# EAGLE design Vayu (EAGLE 9.6.2)

## Sheet 1 of 6: Table of Content
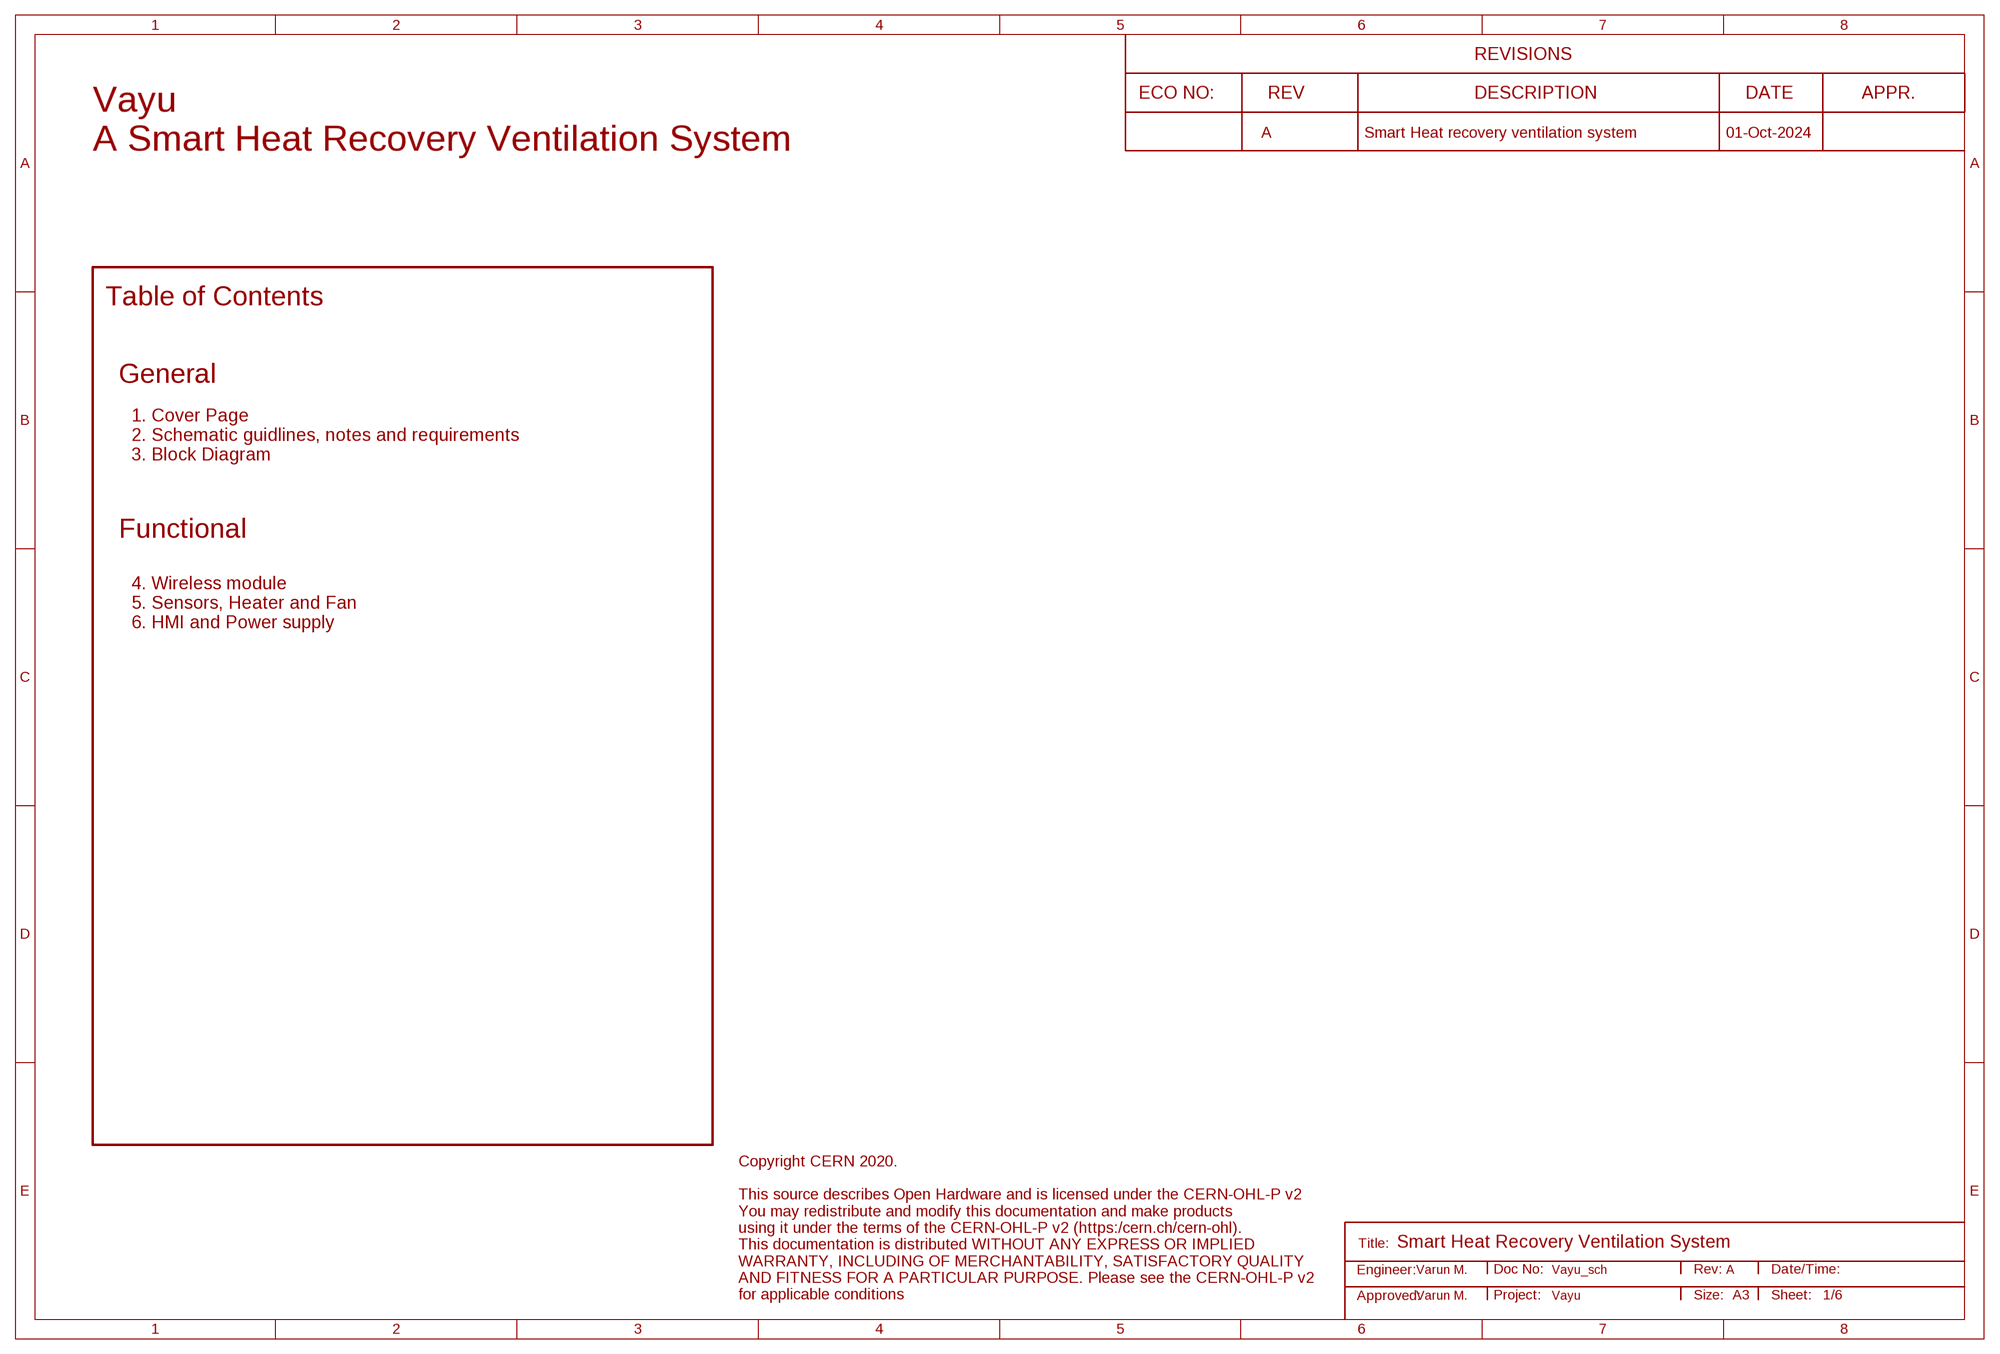
[diagram p0: schematic, sheet 1]
U$1 (A3L-LOC-CERN-OHL-P-V2-TOC): APPROVER: Varun M.; DESCRIPTION: Smart Heat recovery ventilation system; DESIGNER: Varun M.; DOC_NO: Vayu_sch; PROJECT_NAME: Vayu; PROJECT_START_DATE: 01-Oct-2024; REV: A

### Notes on the sheet
- Vayu
  A Smart Heat Recovery Ventilation System
- General
- 1. Cover Page
  2. Schematic guidlines, notes and requirements
  3. Block Diagram
- Functional
- 4. Wireless module
  5. Sensors, Heater and Fan
  6. HMI and Power supply
- Smart Heat Recovery Ventilation System

## Sheet 2 of 6: Schematic Guidelines
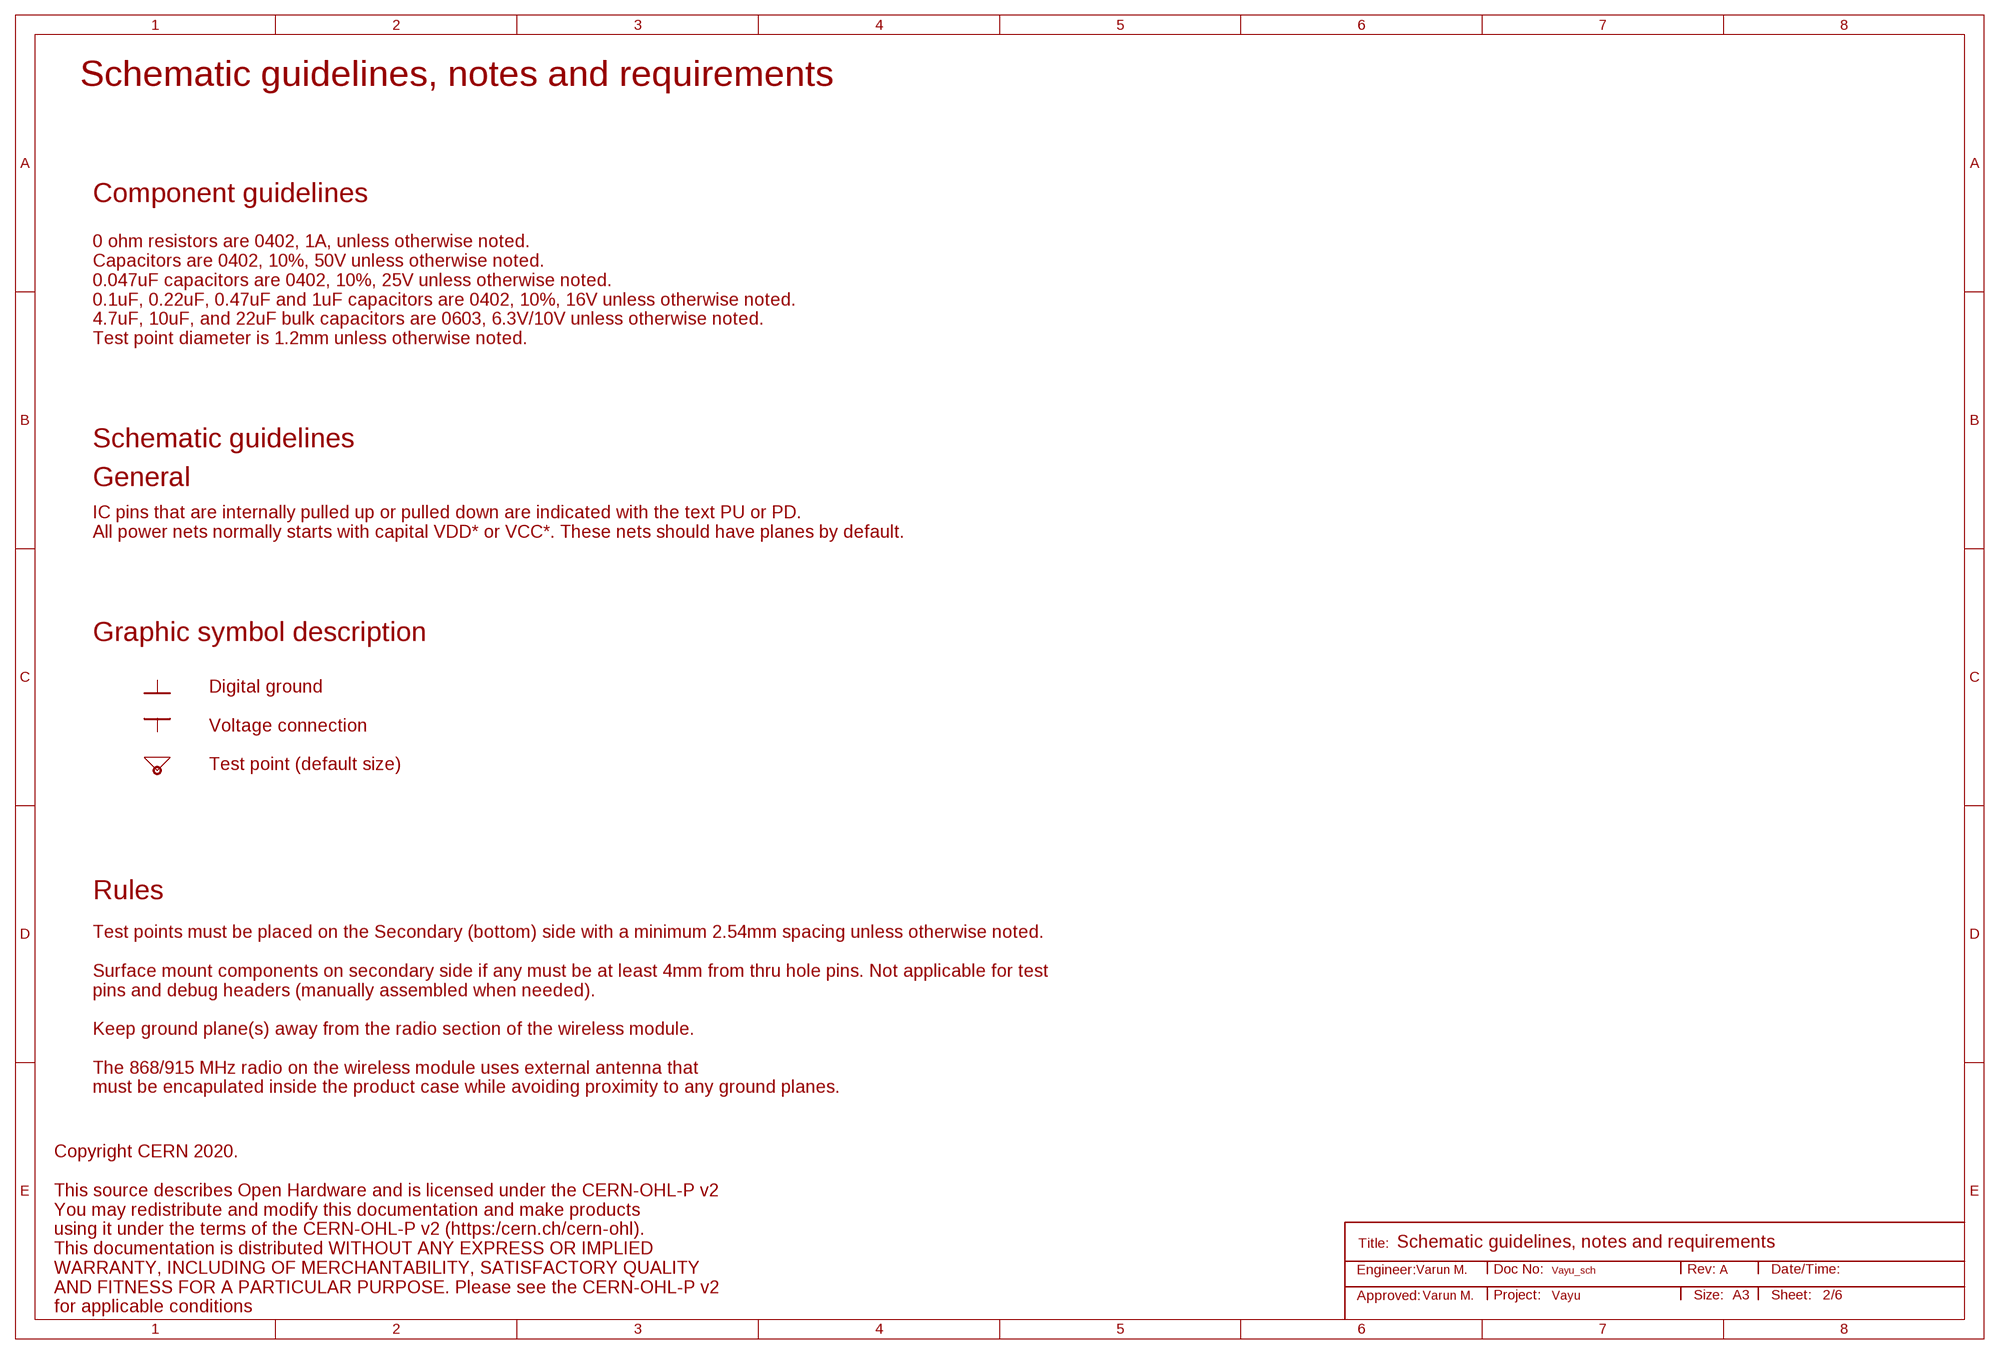
[diagram p1: schematic, sheet 2]
FRAME1 (A3L-LOC-CERN-OHL-P-V2): APPROVER: Varun M.; DESIGNER: Varun M.; DOC_NO: Vayu_sch; PROJECT_NAME: Vayu; REV: A

### Notes on the sheet
- Schematic guidelines, notes and requirements
- Component guidelines
- 0 ohm resistors are 0402, 1A, unless otherwise noted.
  Capacitors are 0402, 10%, 50V unless otherwise noted.
  0.047uF capacitors are 0402, 10%, 25V unless otherwise noted.
  0.1uF, 0.22uF, 0.47uF and 1uF capacitors are 0402, 10%, 16V unless otherwise noted.
  4.7uF, 10uF, and 22uF bulk capacitors are 0603, 6.3V/10V unless otherwise noted.
  Test point diameter is 1.2mm unless otherwise noted.
- Schematic guidelines
- General
- IC pins that are internally pulled up or pulled down are indicated with the text PU or PD.
  All power nets normally starts with capital VDD* or VCC*. These nets should have planes by default.
- Graphic symbol description
- Digital ground
  
  Voltage connection
  
  Test point (default size)
- Rules
- Test points must be placed on the Secondary (bottom) side with a minimum 2.54mm spacing unless otherwise noted.
  
  Surface mount components on secondary side if any must be at least 4mm from thru hole pins. Not applicable for test
  pins and debug headers (manually assembled when needed).
  
  Keep ground plane(s) away from the radio section of the wireless module.
  
  The 868/915 MHz radio on the wireless module uses external antenna that
  must be encapulated inside the product case while avoiding proximity to any ground planes.
- Schematic guidelines, notes and requirements

## Sheet 3 of 6: Block Diagram
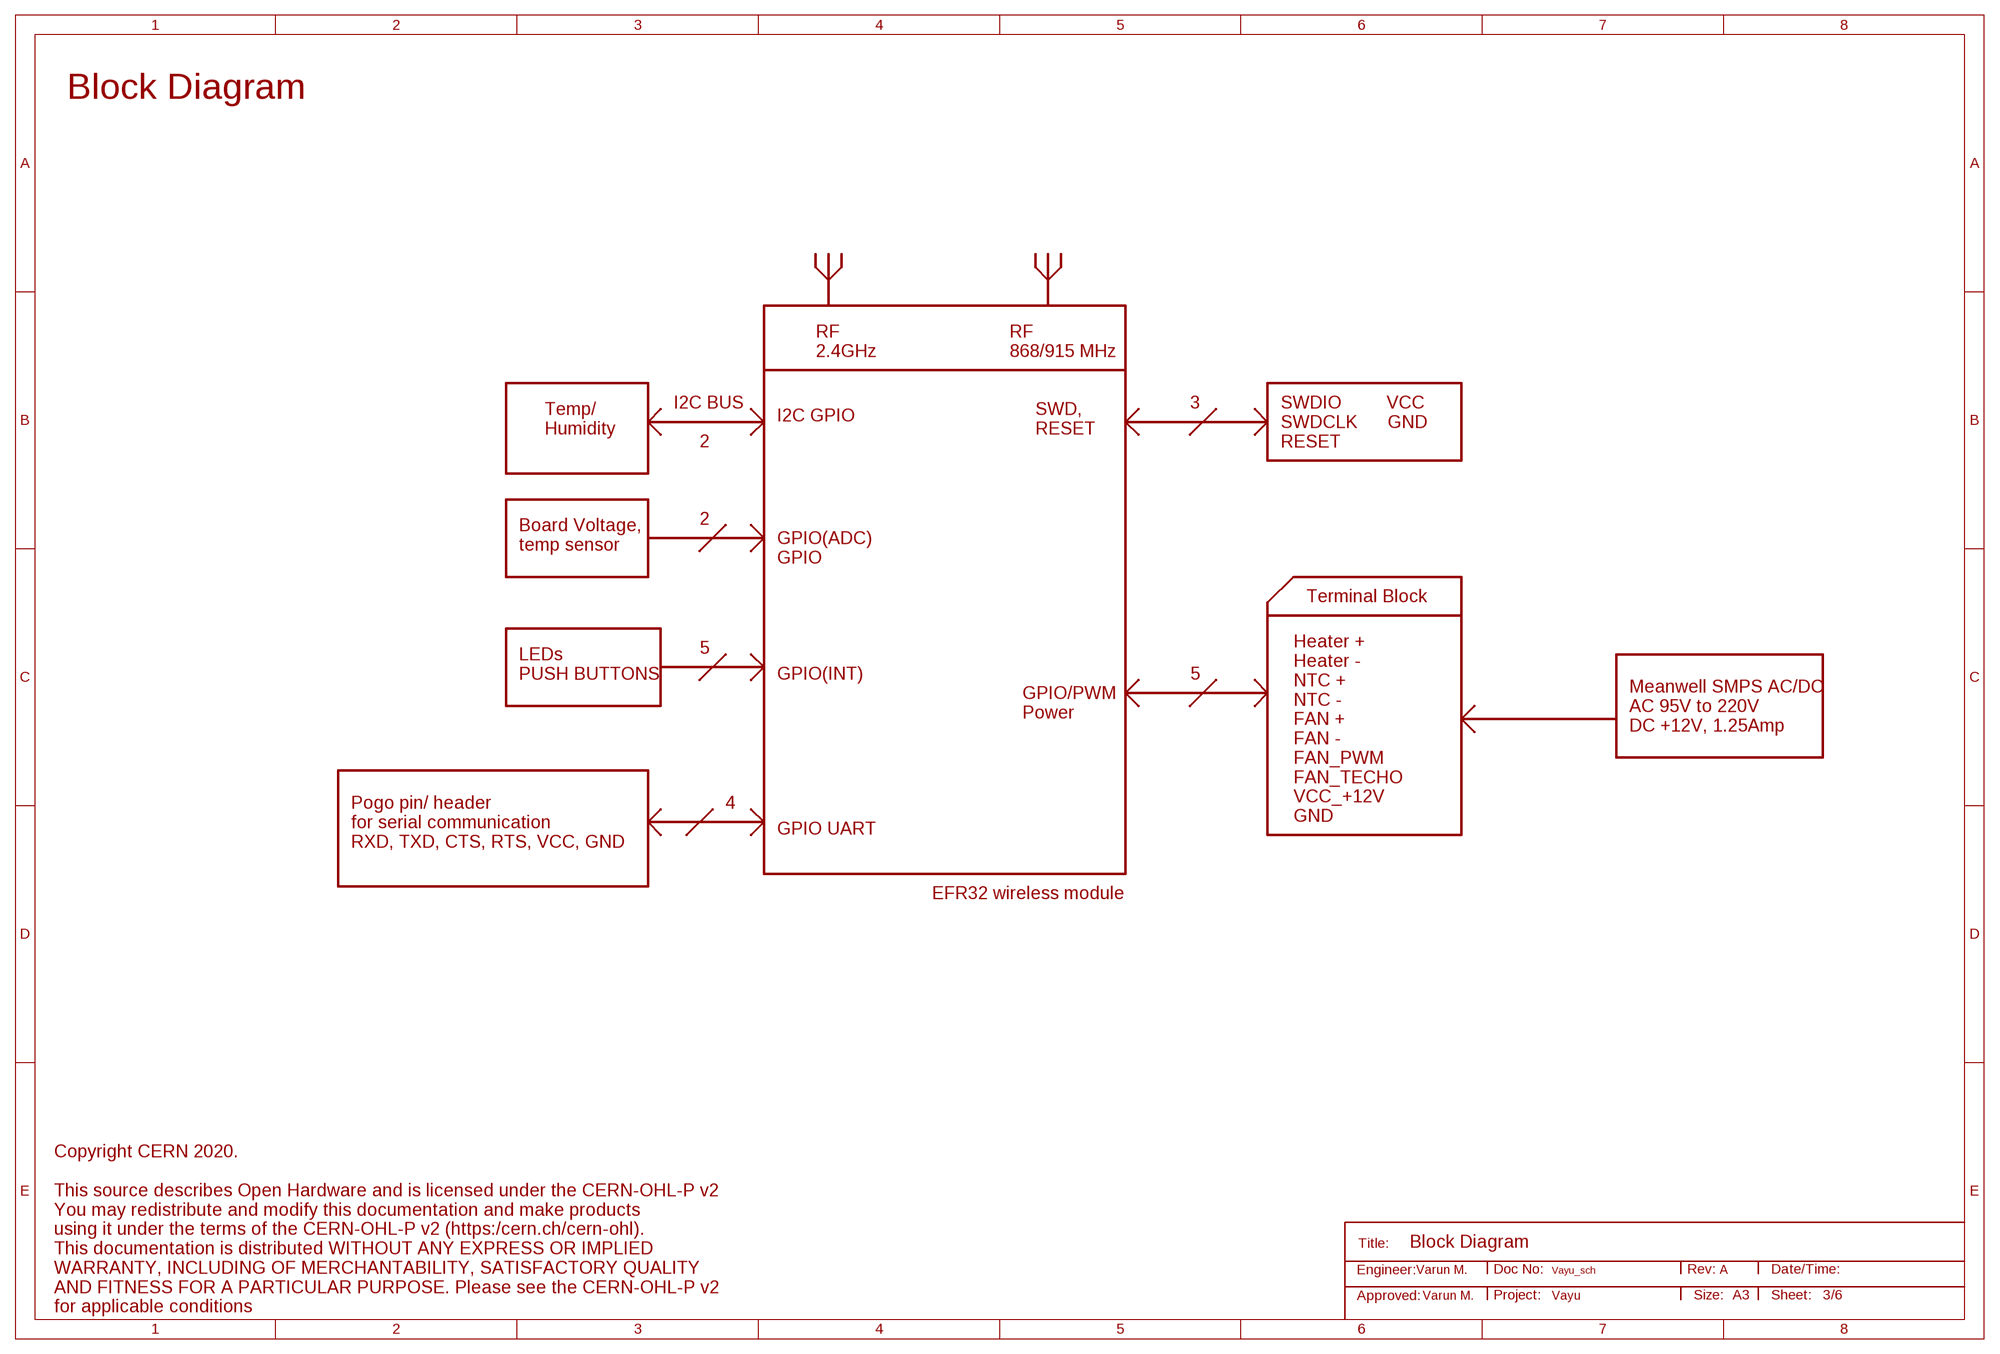
[diagram p2: schematic, sheet 3]
FRAME2 (A3L-LOC-CERN-OHL-P-V2): APPROVER: Varun M.; DESIGNER: Varun M.; DOC_NO: Vayu_sch; PROJECT_NAME: Vayu; REV: A

### Notes on the sheet
- Block Diagram
- RF
  2.4GHz
- RF
  868/915 MHz
- I2C BUS | 3
- I2C GPIO
- Temp/
  Humidity
- SWD,
  RESET
- 2
- SWDIO         VCC
  SWDCLK      GND
  RESET
- 2
- Board Voltage,
  temp sensor
- GPIO(ADC)
  GPIO
- Terminal Block
- 5
- LEDs
  PUSH BUTTONS
- GPIO(INT) | 5
- GPIO/PWM
  Power
- Meanwell SMPS AC/DC
  AC 95V to 220V
  DC +12V, 1.25Amp
- 4
- Heater +
  Heater -
  NTC +
  NTC -
  FAN +
  FAN -
  FAN_PWM
  FAN_TECHO
  VCC_+12V
  GND
- GPIO UART
- Pogo pin/ header
  for serial communication
  RXD, TXD, CTS, RTS, VCC, GND
- EFR32 wireless module
- Block Diagram

## Sheet 4 of 6: Wireless Mdoule
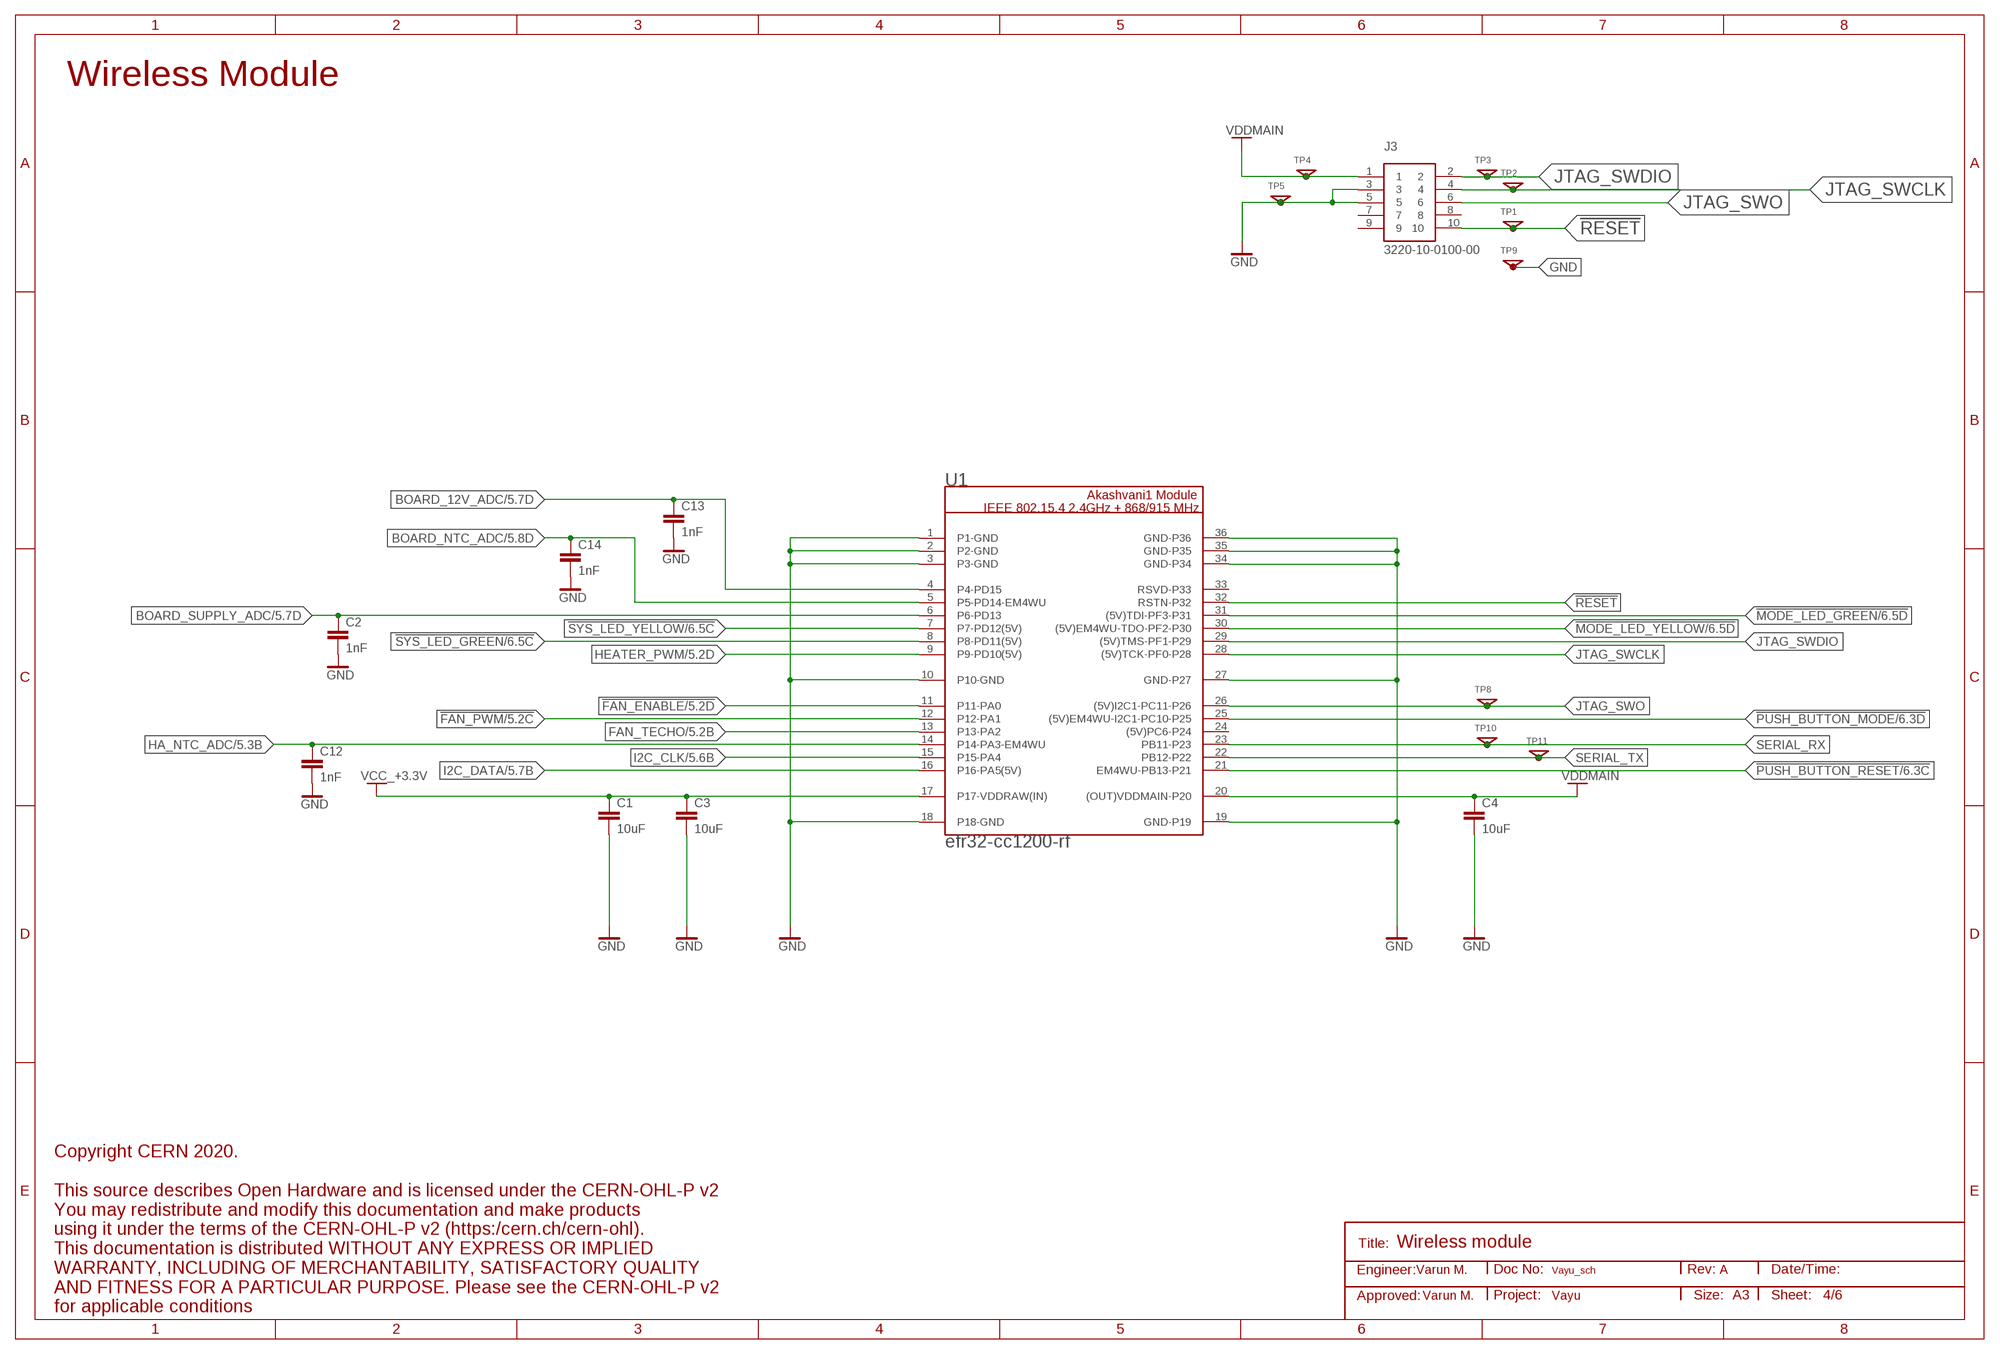
[diagram p3: schematic, sheet 4]
FRAME3 (A3L-LOC-CERN-OHL-P-V2): APPROVER: Varun M.; DESIGNER: Varun M.; DOC_NO: Vayu_sch; PROJECT_NAME: Vayu; REV: A

### Parts
C1  10uF  C-EUC0603  [C0603]
C2  1nF  C-EUC0402S  [CAPC1005X55N]
C3  10uF  C-EUC0603  [C0603]
C4  10uF  C-EUC0603  [C0603]
C12  1nF  C-EUC0402S  [CAPC1005X55N]
C13  1nF  C-EUC0402S  [CAPC1005X55N]
C14  1nF  C-EUC0402S  [CAPC1005X55N]
J3  3220-10-0100-00  [PIN2X5_1.27MM]
TP1  TP_1.2  [TP_1.2]
TP2  TP_1.2  [TP_1.2]
TP3  TP_1.2  [TP_1.2]
TP4  TP_1.2  [TP_1.2]
TP5  TP_1.2  [TP_1.2]
TP8  TP_1.2  [TP_1.2]
TP9  TP_1.2  [TP_1.2]
TP10  TP_1.2  [TP_1.2]
TP11  TP_1.2  [TP_1.2]
U1  efr32-cc1200-rf  AKASHVANI1  [AKASHVANI1]

### Nets
!FAN_ENABLE: U1.11(P11-PA0) ; also sheet 5
!FAN_PWM: U1.12(P12-PA1) ; also sheet 5
!MODE_LED_GREEN: U1.31((5V)TDI-PF3-P31) ; also sheet 6
!MODE_LED_YELLOW: U1.30((5V)EM4WU-TDO-PF2-P30) ; also sheet 6
!PUSH_BUTTON_MODE: U1.25((5V)EM4WU-I2C1-PC10-P25) ; also sheet 6
!PUSH_BUTTON_RESET: U1.21(EM4WU-PB13-P21) ; also sheet 6
!RESET: J3.10 TP1.1(TP) U1.32(RSTN-P32)
!SYS_LED_GREEN: U1.8(P8-PD11(5V)) ; also sheet 6
!SYS_LED_YELLOW: U1.7(P7-PD12(5V)) ; also sheet 6
BOARD_12V_ADC: C13.1 U1.4(P4-PD15) ; also sheet 5
BOARD_NTC_ADC: C14.1 U1.5(P5-PD14-EM4WU) ; also sheet 5
BOARD_SUPPLY_ADC: C2.1 U1.6(P6-PD13) ; also sheet 5
FAN_TECHO: U1.13(P13-PA2) ; also sheet 5
GND: C1.2 C2.2 C3.2 C4.2 C12.2 C13.2 C14.2 J3.3 J3.5 TP5.1(TP) TP9.1(TP) U1.1(P1-GND) U1.2(P2-GND) U1.3(P3-GND) U1.10(P10-GND) U1.18(P18-GND) U1.19(GND-P19) U1.27(GND-P27) U1.34(GND-P34) U1.35(GND-P35) U1.36(GND-P36) ; also sheet 5,6
HA_NTC_ADC: C12.1 U1.14(P14-PA3-EM4WU) ; also sheet 5
HEATER_PWM: U1.9(P9-PD10(5V)) ; also sheet 5
I2C_CLK: U1.15(P15-PA4) ; also sheet 5
I2C_DATA: U1.16(P16-PA5(5V)) ; also sheet 5
JTAG_SWCLK: J3.4 TP2.1(TP) U1.28((5V)TCK-PF0-P28)
JTAG_SWDIO: J3.2 TP3.1(TP) U1.29((5V)TMS-PF1-P29)
JTAG_SWO: J3.6 TP8.1(TP) U1.26((5V)I2C1-PC11-P26)
SERIAL_RX: TP10.1(TP) U1.23(PB11-P23)
SERIAL_TX: TP11.1(TP) U1.22(PB12-P22)
VCC_+3.3V: C1.1 C3.1 U1.17(P17-VDDRAW(IN)) ; also sheet 5,6
VDDMAIN: C4.1 J3.1 TP4.1(TP) U1.20((OUT)VDDMAIN-P20) ; also sheet 5
Unconnected: J3.7 J3.8 J3.9 U1.24((5V)PC6-P24) U1.33(RSVD-P33)

### Notes on the sheet
- Wireless Module
- Wireless module

## Sheet 5 of 6: Sensor, Fan and heater
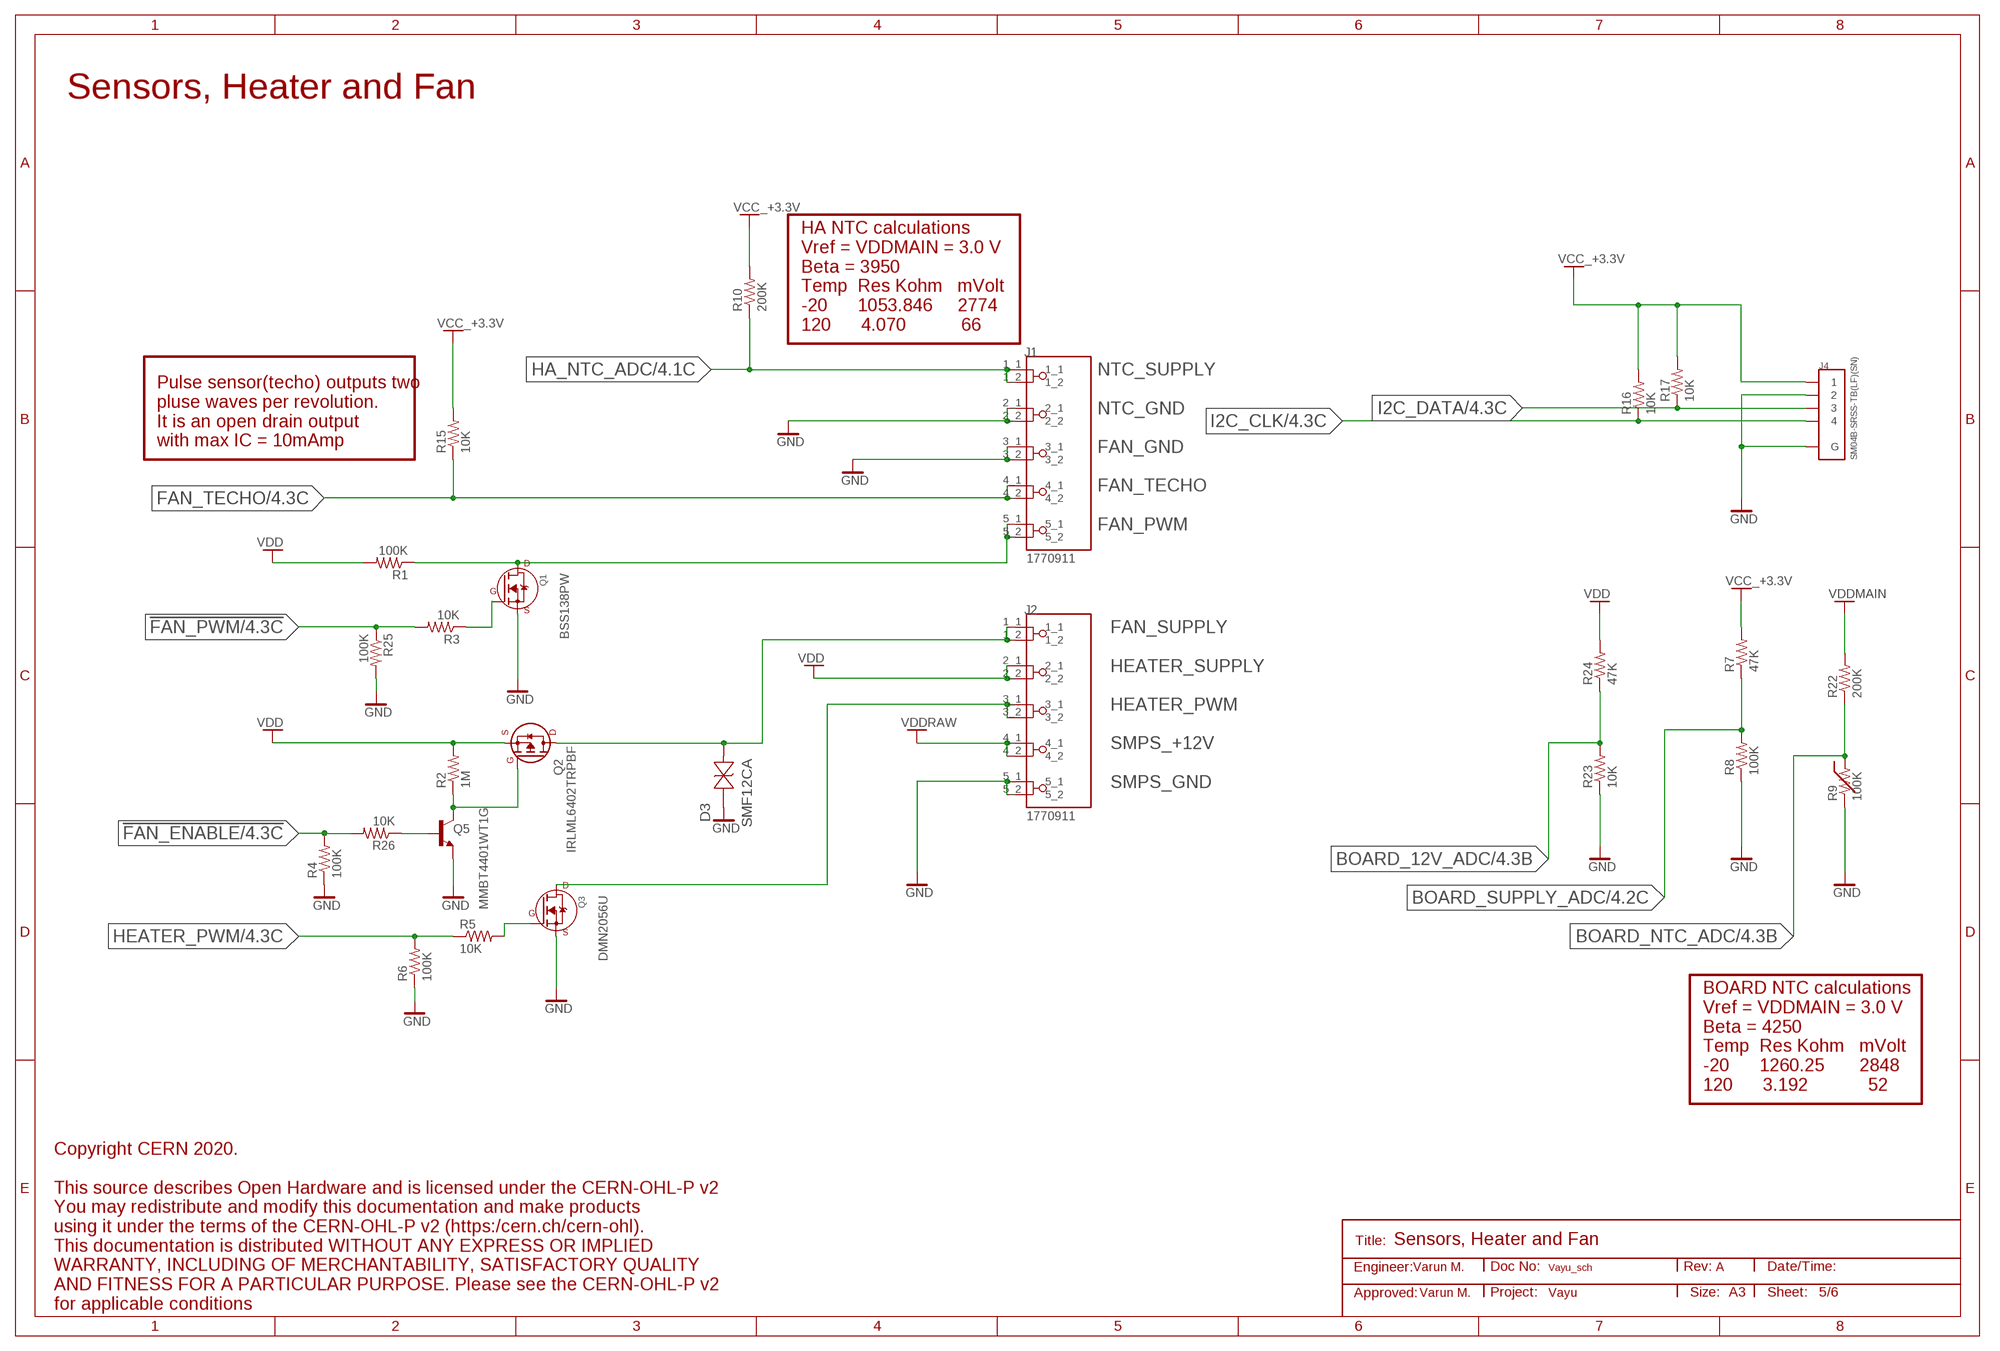
[diagram p4: schematic, sheet 5]
FRAME4 (A3L-LOC-CERN-OHL-P-V2): APPROVER: Varun M.; DESIGNER: Varun M.; DOC_NO: Vayu_sch; PROJECT_NAME: Vayu; REV: A

### Parts
D3  SMF12CA  [SOD-123F-BI]
J1  1770911  [PHOENIX_1770911]
J2  1770911  [PHOENIX_1770911]
J4  SM04B-SRSS-TB(LF)(SN)  [JST_SM04B-SRSS-TB(LF)(SN)]
Q1  BSS138PW  [SC-70_SOT323]
Q2  IRLML6402TRPBF  [SOT23-3]
Q3  DMN2056U  [SOT23-3]
Q5  MMBT4401WT1G  [SOT323-BEC]
R1  100K  R-US_R0402  [R0402]
R2  1M  R-US_R0402  [R0402]
R3  10K  R-US_R0402  [R0402]
R4  100K  R-US_R0402  [R0402]
R5  10K  R-US_R0402  [R0402]
R6  100K  R-US_R0402  [R0402]
R7  47K  R-US_R0402  [R0402]
R8  100K  R-US_R0402  [R0402]
R9  100K  R-NTCR0402  [R0402]
R10  200K  R-US_R0402  [R0402]
R15  10K  R-US_R0402  [R0402]
R16  10K  R-US_R0402  [R0402]
R17  10K  R-US_R0402  [R0402]
R22  200K  R-US_R0402  [R0402]
R23  10K  R-US_R0402  [R0402]
R24  47K  R-US_R0402  [R0402]
R25  100K  R-US_R0402  [R0402]
R26  10K  R-US_R0402  [R0402]

### Nets
!FAN_ENABLE: R4.2 R26.2 ; also sheet 4
!FAN_PWM: R3.2 R25.1 ; also sheet 4
BOARD_12V_ADC: R23.2 R24.1 ; also sheet 4
BOARD_NTC_ADC: R9.2 R22.1 ; also sheet 4
BOARD_SUPPLY_ADC: R7.1 R8.2 ; also sheet 4
FAN_SPEED: J1.5_1 J1.5_2 Q1.3(D) R1.1
FAN_SUPPLY: D3.1 J2.1_1 J2.1_2 Q2.D
FAN_TECHO: J1.4_1 J1.4_2 R15.1 ; also sheet 4
GND: D3.2 J1.2_1 J1.2_2 J1.3_1 J1.3_2 J2.5_1 J2.5_2 J4.2 J4.S1(G) J4.S2(G) Q1.2(S) Q3.S Q5.E R4.1 R6.1 R8.1 R9.1 R23.1 R25.2 ; also sheet 4,6
HA_NTC_ADC: J1.1_1 J1.1_2 R10.1 ; also sheet 4
HEATER: J2.3_1 J2.3_2 Q3.D
HEATER_PWM: R5.1 R6.2 ; also sheet 4
I2C_CLK: J4.4 R16.1 ; also sheet 4
I2C_DATA: J4.3 R17.1 ; also sheet 4
N$1: Q1.1(G) R3.1
N$2: Q3.G R5.2
N$5: Q5.B R26.1
PMOSFET_EN: Q2.G Q5.C R2.1
VCC_+3.3V: J4.1 R7.2 R10.2 R15.2 R16.2 R17.2 ; also sheet 4,6
VDD: J2.2_1 J2.2_2 Q2.S R1.2 R2.2 R24.2 ; also sheet 6
VDDMAIN: R22.2 ; also sheet 4
VDDRAW: J2.4_1 J2.4_2 ; also sheet 6

### Notes on the sheet
- Sensors, Heater and Fan
- HA NTC calculations
  Vref = VDDMAIN = 3.0 V
  Beta = 3950
  Temp  Res Kohm   mVolt
  -20      1053.846     2774
  120      4.070           66
- Pulse sensor(techo) outputs two 
  pluse waves per revolution. 
  It is an open drain output
  with max IC = 10mAmp
- NTC_SUPPLY
  
  NTC_GND
  
  FAN_GND
  
  FAN_TECHO
  
  FAN_PWM
- FAN_SUPPLY
  
  HEATER_SUPPLY
  
  HEATER_PWM
  
  SMPS_+12V
  
  SMPS_GND
- BOARD NTC calculations
  Vref = VDDMAIN = 3.0 V
  Beta = 4250
  Temp  Res Kohm   mVolt
  -20      1260.25       2848
  120      3.192            52
- Sensors, Heater and Fan

## Sheet 6 of 6: HMI and Power supply
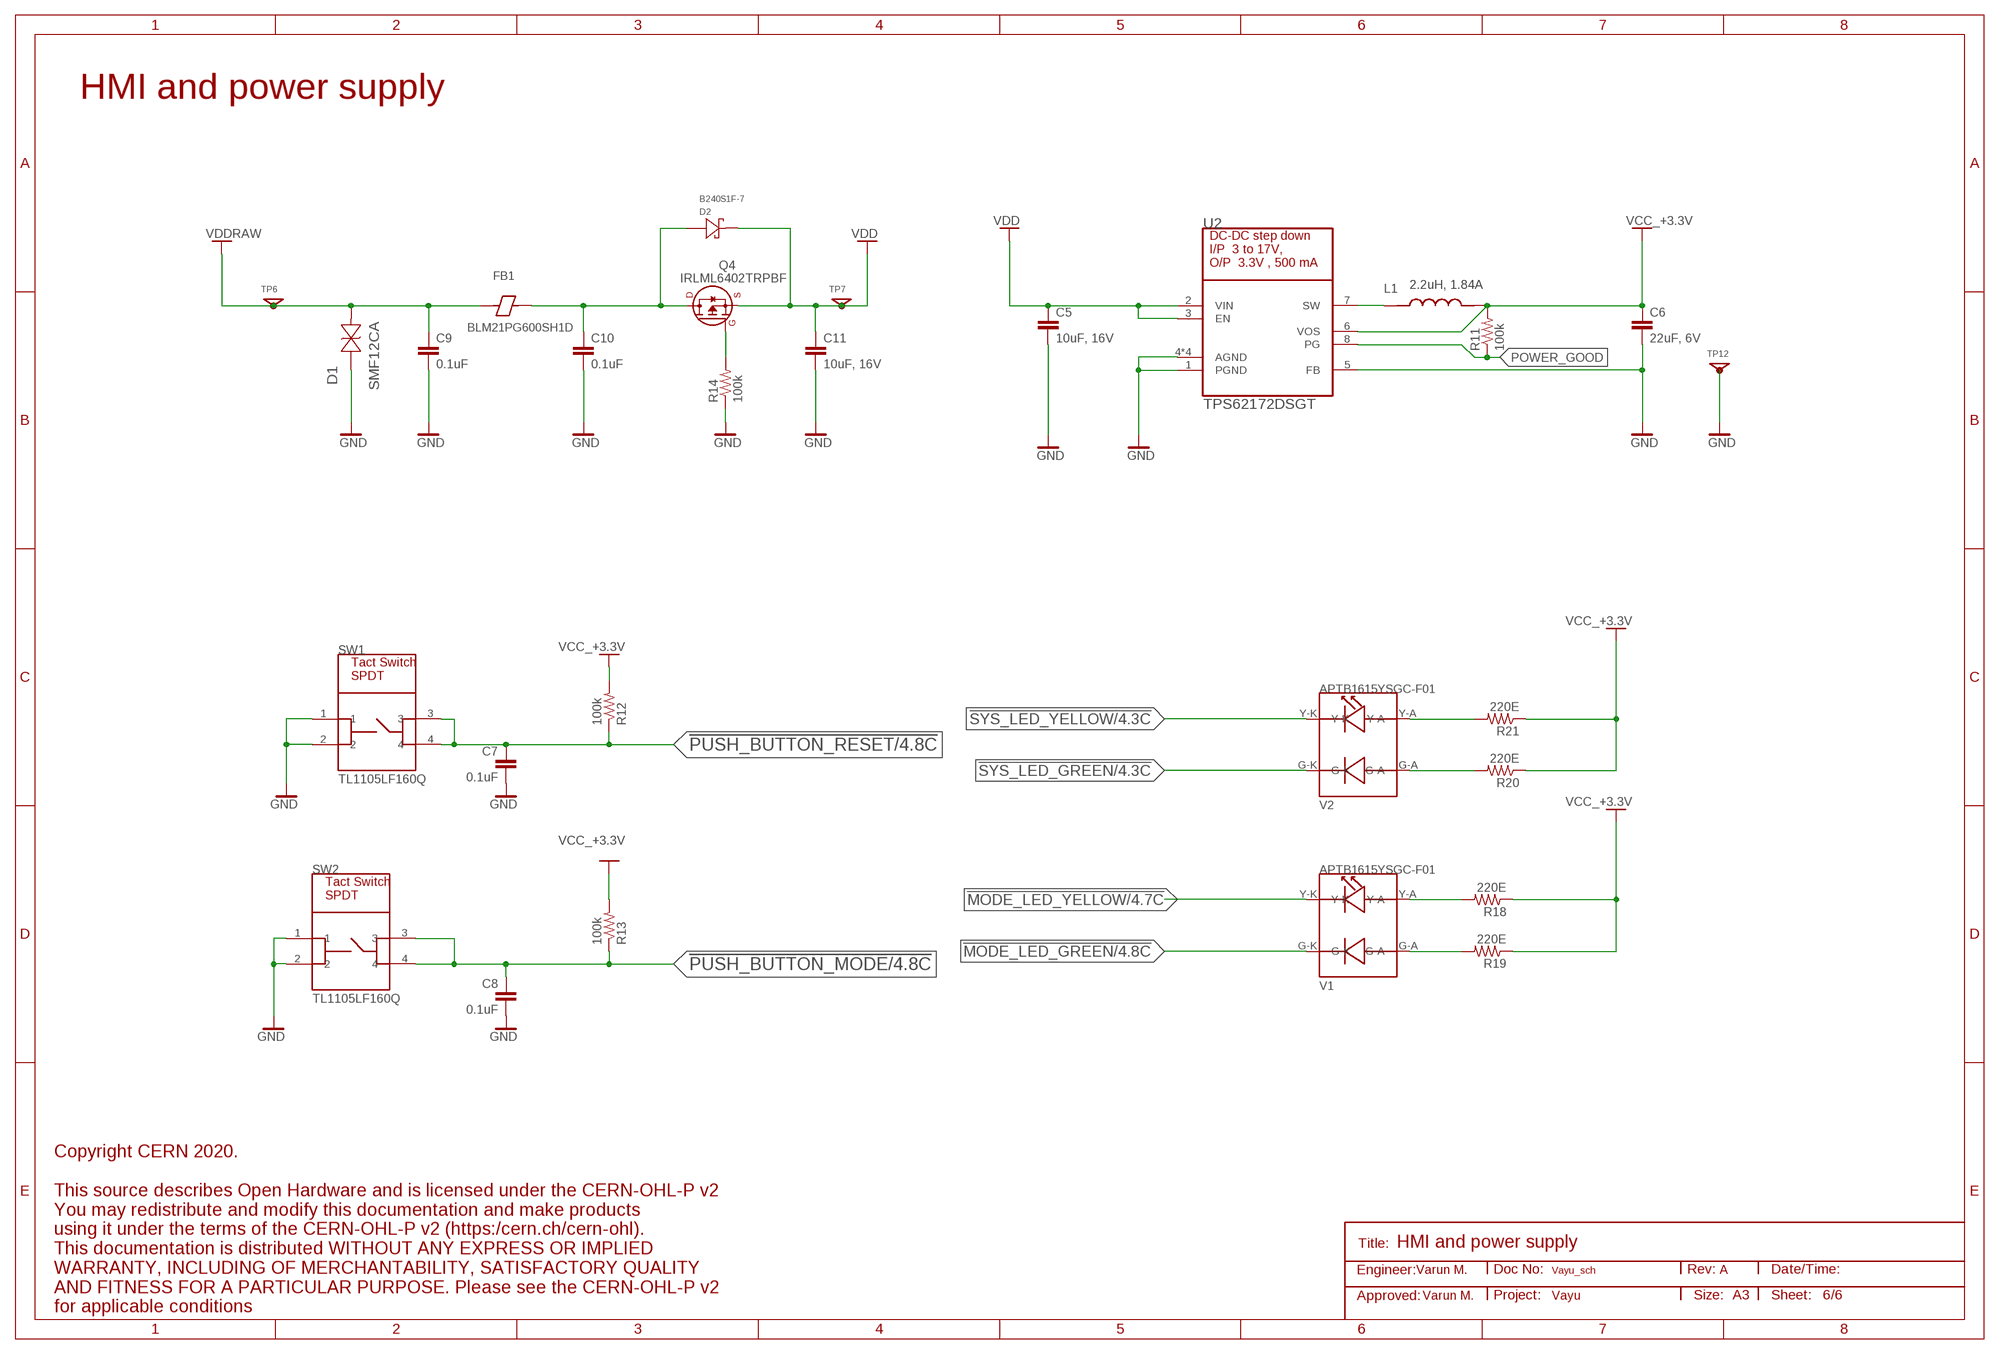
[diagram p5: schematic, sheet 6]
FRAME5 (A3L-LOC-CERN-OHL-P-V2): APPROVER: Varun M.; DESIGNER: Varun M.; DOC_NO: Vayu_sch; PROJECT_NAME: Vayu; REV: A

### Parts
C5  10uF, 16V  C-EUC0805  [C0805]
C6  22uF, 6V  C-EUC0603  [C0603]
C7  0.1uF  C-EUC0402S  [CAPC1005X55N]
C8  0.1uF  C-EUC0402S  [CAPC1005X55N]
C9  0.1uF  C-EUC0402S  [CAPC1005X55N]
C10  0.1uF  C-EUC0402S  [CAPC1005X55N]
C11  10uF, 16V  C-EUC0805  [C0805]
D1  SMF12CA  [SOD-123F-BI]
D2  B240S1F-7  MBR1020VL  [SOD-123F]
FB1  BLM21PG600SH1D  [BEADC2012X105N]
L1  2.2uH, 1.84A  VLS201612HBX-2R2M-1  [IND_VLS201612HBX-2R2M-1]
Q4  IRLML6402TRPBF  [SOT23-3]
R11  100k  R-US_R0402  [R0402]
R12  100k  R-US_R0402  [R0402]
R13  100k  R-US_R0402  [R0402]
R14  100k  R-US_R0402  [R0402]
R18  220E  R-US_R0402  [R0402]
R19  220E  R-US_R0402  [R0402]
R20  220E  R-US_R0402  [R0402]
R21  220E  R-US_R0402  [R0402]
SW1  TL1105LF160Q  [TACT_TH_6X6X17MM]
SW2  TL1105LF160Q  [TACT_TH_6X6X17MM]
TP6  TP_1.2  [TP_1.2]
TP7  TP_1.2  [TP_1.2]
TP12  TP_1.2  [TP_1.2]
U2  TPS62172DSGT  [SON50P200X200X80-9N]
V1  APTB1615YSGC-F01  [LED-0606]
V2  APTB1615YSGC-F01  [LED-0606]

### Nets
!MODE_LED_GREEN: V1.G-K ; also sheet 4
!MODE_LED_YELLOW: V1.Y-K ; also sheet 4
!PUSH_BUTTON_MODE: C8.1 R13.1 SW2.3 SW2.4 ; also sheet 4
!PUSH_BUTTON_RESET: C7.1 R12.1 SW1.3 SW1.4 ; also sheet 4
!SYS_LED_GREEN: V2.G-K ; also sheet 4
!SYS_LED_YELLOW: V2.Y-K ; also sheet 4
GND: C5.2 C6.2 C7.2 C8.2 C9.2 C10.2 C11.2 D1.2 R14.1 SW1.1 SW1.2 SW2.1 SW2.2 TP12.1(TP) U2.1(PGND) U2.4(AGND) U2.5(FB) U2.9(AGND) U2.9_1(AGND) U2.9_2(AGND) ; also sheet 4,5
N$4: L1.1 U2.7(SW)
N$6: C10.1 D2.A FB1.2 Q4.D
N$7: Q4.G R14.2
N$8: R21.2 V2.Y-A
N$9: R20.2 V2.G-A
N$10: R18.2 V1.Y-A
N$11: R19.2 V1.G-A
POWER_GOOD: R11.1 U2.8(PG)
VCC_+3.3V: C6.1 L1.2 R11.2 R12.2 R13.2 R18.1 R19.1 R20.1 R21.1 U2.6(VOS) ; also sheet 4,5
VDD: C5.1 C11.1 D2.K Q4.S TP7.1(TP) U2.2(VIN) U2.3(EN) ; also sheet 5
VDDRAW: C9.1 D1.1 FB1.1 TP6.1(TP) ; also sheet 5

### Notes on the sheet
- HMI and power supply
- HMI and power supply

## Library data of the parts
C1 C3-C6 C11 = rcl:C-EU: CAPACITOR, European symbol; SPICEPREFIX: C
C2 C7-C10 C12-C14 = rcl:C-EU: CAPACITOR, European symbol
D1 D3 = diodes:SMF12CA: REverse standoff 12Volt, Breakdown 13.3V, 14.7V Clamp 10.1A Ipp Tvs Diode Surface Mount SOD-123F
D2 = diodes:MBR1020VL: MBR1020VL Surface Mount Schottky Power rectifier Vrrm = 20volts, If = 1.0 Amp, Vf = 0.34 Volts
FB1 = filters:BLM21PG600SH1D: 60 Ohms @ 100 MHz 1 Power Line Ferrite Bead 0805 (2012 Metric) 3.5A 20mOhm; DESCRIPTION: 60 Ohms @ 100 MHz 1 Power Line Ferrite Bead 0805 (2012 Metric) 3.5A 20mOhm; DIGI-KEY_PART_NUMBER: 490-7824-1-ND; MF: Murata Electronics; MP: BLM21PG600SH1D; PACKAGE: 0805; PURCHASE-URL: https://pricing.snapeda.com/search/part/BLM21PG600SH1D/?ref=eda
J1 J2 = connectors:1770911: 5 Position Wire to Board Terminal Block Horizontal with Board 0.098" (2.50mm) Through Hole; MANUFACTURER: PHOENIX
J3 = connectors:3220-10-0100-00: Connector Header Through Hole 10 position 0.050" (1.27mm)
J4 = connectors:SM04B-SRSS-TB(LF)(SN): SH Series 1.0 mm Pitch 2 Position Single Row Side Entry Shrouded Header; DESCRIPTION: Connector Header Surface Mount, Right Angle 4 position 0.039 (1.00mm); DIGI-KEY_PART_NUMBER: 455-1804-1-ND; MF: JST Sales; MP: SM04B-SRSS-TB(LF)(SN); PACKAGE: None
L1 = inductors:VLS201612HBX-2R2M-1: 2.2 µH Shielded Drum Core, Wirewound Inductor 1.85 A 137mOhm Max 0806 (2016 Metric); MANUFACTURER: TDK; MAXIMUM_PACKAGE_HEIGHT: 1.2 mm; PARTREV: N/A; STANDARD: Manufacturer Recommendations
Q1 = mosfets:BSS138PW: BSS138PW 60 V, 320 mA N-channel Trench MOSFET
Q2 Q4 = mosfets:IRLML6402TRPBF: P-Channel 20V 3.7A (Ta) 1.3W (Ta) Surface Mount Micro3™/SOT-23
Q3 = mosfets:DMN2056U: Diodes Inc. DMN5056U 20V N-CHANNEL ENHANCEMENT MODE MOSFET, 4.0 Amp, 38mOhm Rds, Vgth 1.0Volt
Q5 = transistors-BJT:MMBT4401WT1G: Bipolar (BJT) Transistor NPN 40 V 600 mA 250MHz 150 mW Surface Mount SC-70-3 (SOT323)
R1-R8 R10-R26 = rcl:R-US_: RESISTOR, American symbol; SPICEPREFIX: R
R9 = sensors_iot:R-NTC: RESISTOR, American symbol; SPICEPREFIX: R
SW1 SW2 = switch-button:TL1105LF160Q: SWITCH TACTILE SPST-NO 0.05A 12V 6x6mm. Actuator height from PCB 17mm
TP1-TP12 = test_points:TP_1.2: Test point 1.2 mm diameter
U1 = rf_soc_modules:AKASHVANI1: Akshavani1 2.4GHz, 868/915 MHz radio module
U2 = voltage_regulators:TPS62172DSGT: TPS6217x 3-V to 17-V, 0.5-A Step-Down Converter swith DCS-Control
V1 V2 = leds:APTB1615YSGC-F01: Bi-color LED 0606 (1616 metric)

## Board
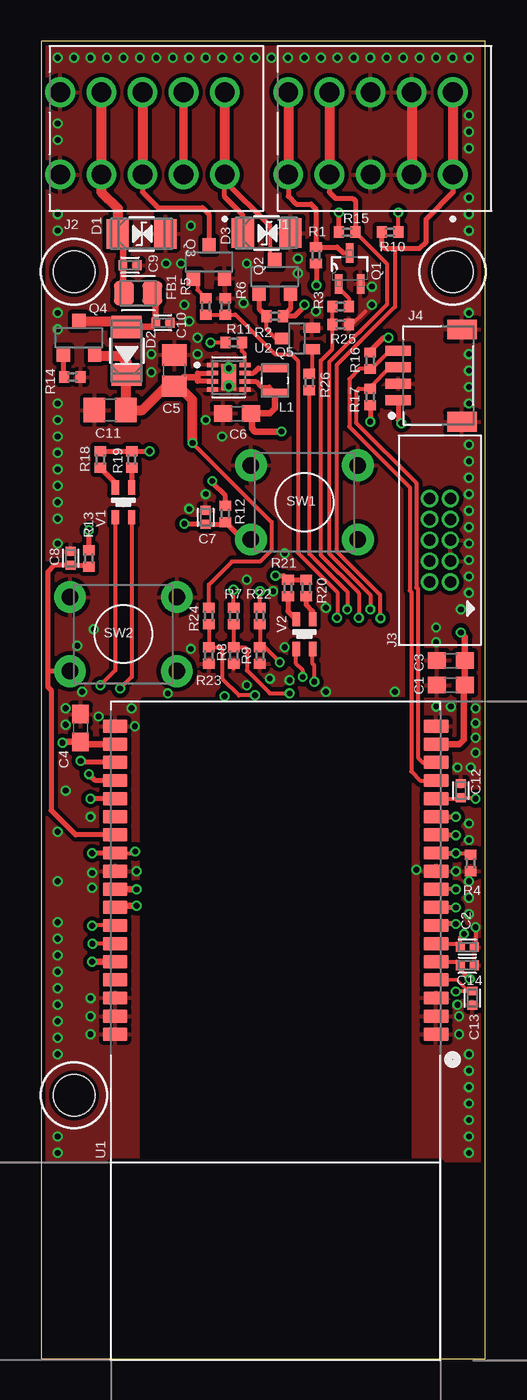
[diagram p6: board, top side]
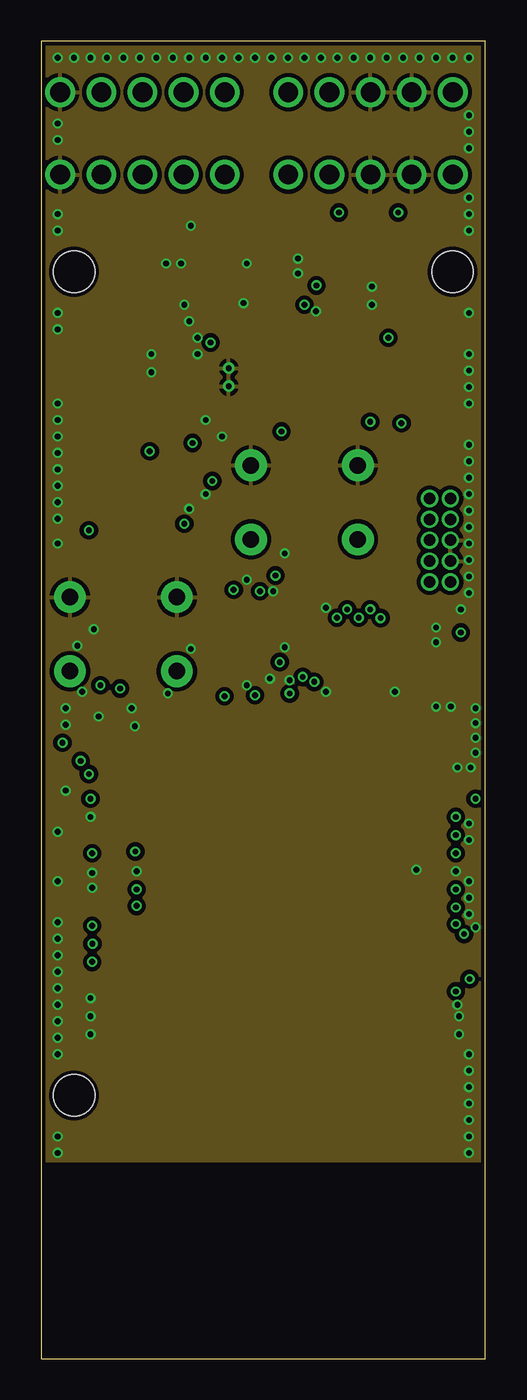
[diagram p7: board, inner layer GND]
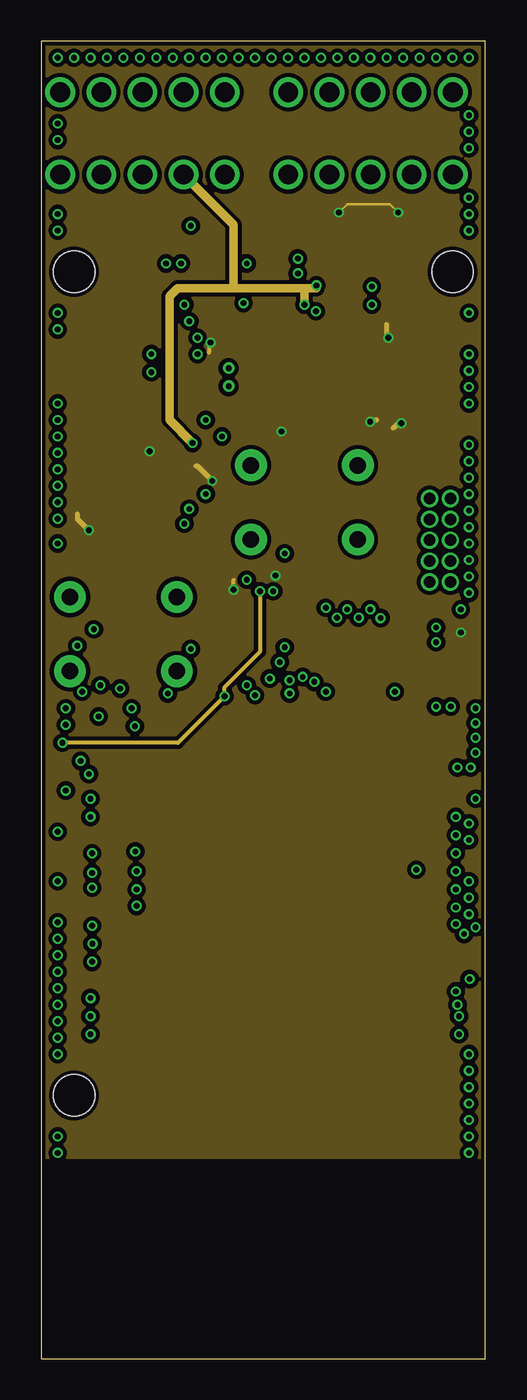
[diagram p8: board, inner layer POWER]
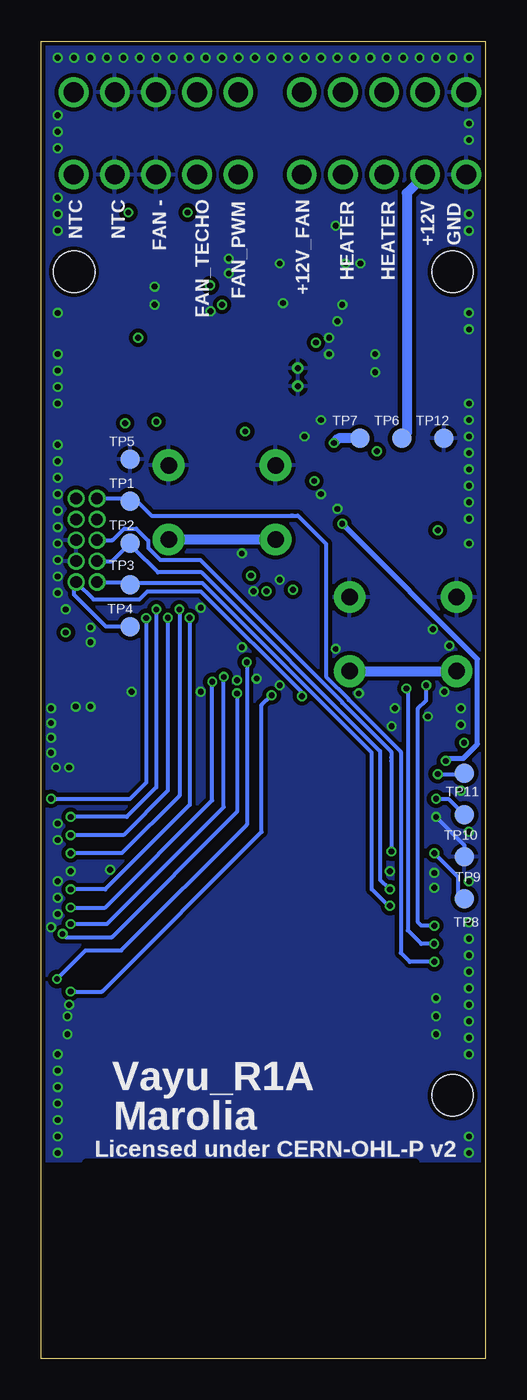
[diagram p9: board, bottom side, seen from below]

Size 27 x 80 mm. Coordinates in mm from the lower left corner, seen from the top.
Outline: 0,0 27,0 27,80 0,80 0,0
Copper layers (1+2*15+16): Top 0.035mm / dielectric 0.15mm / GND 0.035mm / dielectric 1.12mm / POWER 0.035mm / dielectric 0.15mm / Bottom 0.035mm
Design rules "Vayu": minimum track width 0.15mm, minimum drill 0.35mm, track to track 0.15mm, track to pad 0.15mm, pad to pad 0.15mm, via to via 0.15mm, smd to smd 0mil, copper to edge 0.25mm, drill to drill 0.35mm, minimum pad ring 0.175mm, minimum via ring 0.125mm, stop-mask expansion 0mil, vias tented up to drill 0.35mm, thermal gap 0.25mm
Holes 2.5 mm at 2,66 25,66 2,16

### Footprints (pad centres in the part's own frame; a part is rotated, then mirrored left to right if it is on the bottom)
C0603 = smd 1.1 x 1: 1 -0.85,0; 2 0.85,0
CAPC1005X55N = smd 0.54 x 0.6: 1 -0.43,0; 2 0.43,0
C0805 = smd 1.3 x 1.5: 1 -0.95,0; 2 0.95,0
SOD-123F-BI = smd 1.35 x 1.8: 1 -1.45,0; 2 1.45,0
SOD-123F = smd 1.35 x 1.8: A 1.45,0; K -1.45,0
BEADC2012X105N = smd 1.2 x 1.47: 1 -0.86,0; 2 0.86,0
PHOENIX_1770911 = drill 1.2: 1_1 2.35,7.8; 1_2 2.35,2.8; 2_1 4.85,7.8; 2_2 4.85,2.8; 3_1 7.35,7.8; 3_2 7.35,2.8; 4_1 9.85,7.8; 4_2 9.85,2.8; 5_1 12.35,7.8; 5_2 12.35,2.8
PIN2X5_1.27MM = drill 0.7 pad 1.016: 1 -2.54,-0.67; 2 -2.54,0.6; 3 -1.27,-0.67; 4 -1.27,0.6; 5 0,-0.67; 6 0,0.6; 7 1.27,-0.67; 8 1.27,0.6; 9 2.54,-0.67; 10 2.54,0.6
JST_SM04B-SRSS-TB(LF)(SN) = smd 0.6 x 1.55: 1 -1.5,0; 2 -0.5,0; 3 0.5,0; 4 1.5,0 | smd 1.2 x 1.8: S1 -2.8,-3.875; S2 2.8,-3.875
IND_VLS201612HBX-2R2M-1 = smd 0.5 x 1.6: 1 -0.75,0; 2 0.75,0
SC-70_SOT323 = smd 1.168 x 0.457: 1 -0.94,0.66; 2 -0.94,-0.66; 3 0.94,0
SOT23-3 = smd 0.8 x 0.9: D 0,1; G -0.95,-1; S 0.95,-1
SOT323-BEC = smd 0.6 x 1: B -0.65,-0.9; E 0.65,-0.9 | smd 0.7 x 0.9: C 0,0.9
R0402 = smd 0.6 x 0.7: 1 -0.5,0; 2 0.5,0
TACT_TH_6X6X17MM = drill 1 pad 1.93: 1 -3.25,2.25; 2 3.25,2.25; 3 -3.25,-2.25; 4 3.25,-2.25
TP_1.2 = smd 1.2 x 1.2: 1 0,0
AKASHVANI1 = smd 1.5 x 0.8: 1 -9.75,0.2; 2 -9.75,-0.9; 3 -9.75,-2; 4 -9.75,-3.1; 5 -9.75,-4.2; 6 -9.75,-5.3; 7 -9.75,-6.4; 8 -9.75,-7.5; 9 -9.75,-8.6; 10 -9.75,-9.7; 11 -9.75,-10.8; 12 -9.75,-11.9; 13 -9.75,-13; 14 -9.75,-14.1; 15 -9.75,-15.2; 16 -9.75,-16.3; 17 -9.75,-17.4; 18 -9.75,-18.5; 19 9.75,-18.5; 20 9.75,-17.4; 21 9.75,-16.3; 22 9.75,-15.2; 23 9.75,-14.1; 24 9.75,-13; 25 9.75,-11.9; 26 9.75,-10.8; 27 9.75,-9.7; 28 9.75,-8.6; 29 9.75,-7.5; 30 9.75,-6.4; 31 9.75,-5.3; 32 9.75,-4.2; 33 9.75,-3.1; 34 9.75,-2; 35 9.75,-0.9; 36 9.75,0.2
SON50P200X200X80-9N = smd 0.74 x 0.28: 1 -0.985,0.75; 2 -0.985,0.25; 3 -0.985,-0.25; 4 -0.985,-0.75; 5 0.985,-0.75; 6 0.985,-0.25; 7 0.985,0.25; 8 0.985,0.75 | smd 0.9 x 1.6: 9 0,0 | drill 0.35 pad 0.7: 9_1 0,0.55; 9_2 0,-0.55
LED-0606 = smd 0.85 x 0.5: G-A 0.9,-0.5; G-K -0.9,-0.5; Y-A 0.9,0.5; Y-K -0.9,0.5

### Placement (x,y rotation side)
C1  24.9,40.9 180 top
C2  25.9,25 0 top
C3  24.9,42.4 180 top
C4  2.4,38.3 90 top
C5  8.1,60 90 top
C6  11.9,57.4 180 top
C7  10,51.1 90 top
C8  1.8,48.6 90 top
C9  5.4,66.4 0 top
C10  7.4,62.9 0 top
C11  4.2,57.6 180 top
C12  25.5,34.5 90 top
C13  26.2,21.9 270 top
C14  25.9,23.9 0 top
D1  6.1,68.3 0 top
D2  5.2,61.2 90 top
D3  13.7,68.35 0 top
FB1  5.9,64.7 0 top
J1  27.37,79.7 180 top
J2  13.51,79.7 180 top
J3  24.2,49.7 90 top
J4  21.7,59.7 90 top
L1  14.2,59.4 270 top
Q1  18.75,66.2 90 top
Q2  14.2,65.7 0 top
Q3  10.2,66.6 0 top
Q4  2.3,62 0 top
Q5  15.55,61.95 90 top
R1  16.7,67 270 top
R2  14.2,63.3 0 top
R3  18.2,63.9 180 top
R4  26.1,30.1 90 top
R5  10,63.9 90 top
R6  11.2,63.9 270 top
R7  11.7,45.1 90 top
R8  11.7,42.7 90 top
R9  13.3,42.7 90 top
R10  21.2,68.4 0 top
R11  11.7,61.7 180 top
R12  11.2,51.3 90 top
R13  2.9,48.6 90 top
R14  1.9,59.6 180 top
R15  18.6,68.4 180 top
R16  20,60.6 90 top
R17  20,58.4 270 top
R18  3.6,54.6 270 top
R19  5.5,54.6 270 top
R20  16.1,46.8 270 top
R21  15,46.8 270 top
R22  13.3,45.1 90 top
R23  10.2,42.7 90 top
R24  10.2,45.1 90 top
R25  18.2,62.8 0 top
R26  16.3,59.3 270 top
SW1  16,52 0 top
SW2  5,44 0 top
TP1  21.59,52.07 0 bottom
TP2  21.59,49.53 0 bottom
TP3  21.59,46.99 0 bottom
TP4  21.59,44.45 0 bottom
TP5  21.59,54.61 0 bottom
TP6  5.08,55.88 0 bottom
TP7  7.62,55.88 0 bottom
TP8  1.27,27.94 180 bottom
TP9  1.27,30.48 180 bottom
TP10  1.27,33.02 180 bottom
TP11  1.27,35.56 180 bottom
TP12  2.54,55.88 0 bottom
U1  14.25,19.91 180 top
U2  11.4,59.6 0 top
V1  5,52 90 top
V2  16,44 90 top

### Tracks (layer width: path | path; a pad name or v marks a point on that pad's centre or on a via)
!FAN_ENABLE  (via drill 0.35)
  Top 0.254: v18.6,45.5 18.6,46.58 16.3,48.88 R26.2 | v25.2,30.7 26,30.7 R4.2
  Top 0.305: U1.11 v25.19,30.71 v25.2,30.7
  Bottom 0.254: v18.6,45.5 18.6,34.2 22.1,30.7 v25.2,30.7
!FAN_PWM  (via drill 0.35)
  Top 0.254: v19.3,45 19.3,46.5 17,48.8 17,60.6 17.7,61.3 R25.1 R3.2
  Top 0.305: U1.12 v25.19,31.81 v25.2,31.8
  Bottom 0.254: v19.3,45 19.3,34.5 22,31.8 v25.2,31.8
!MODE_LED_GREEN  (via drill 0.35)
  Top 0.254: V1.G-K 5.5,41.4 v4.8,40.7 | U1.31 v3.12,25.2
  Bottom 0.254: v3.12,25.2 3.9,25.2 4.71,26.01 4.71,40.61 v4.8,40.7
!MODE_LED_YELLOW  (via drill 0.35)
  Top 0.254: V1.Y-K 4.5,41.8 v3.6,40.9 | v3.1,26.3 v3.11,26.31 U1.30
  Bottom 0.254: v3.1,26.3 3.9,26.3 4.1,26.5 4.1,39.48 3.6,39.98 v3.6,40.9
!PUSH_BUTTON_MODE
  Top 0.305: U1.25 2.09,31.81 0.6,33.3 0.6,40.6 0.4,40.8 0.4,41.8 | R13.1 2.83,48.17 C8.1 1.77,48.2 0.8,48.2 0.4,47.8 0.4,41.8 | SW2.3 0.45,41.75 0.4,41.8
  Bottom 0.61: SW2.4 SW2.3
!PUSH_BUTTON_RESET  (via drill 0.35)
  Top 0.305: SW1.3 12.25,49.75 R12.1 11.07,50.67 C7.1 9.97,50.7 v8.7,50.7 | U1.21 2.49,36.21 v2.4,36.3
  Bottom 0.305: v2.4,36.3 v2.4,36.31 2.24,36.46 1.34,36.46 0.48,37.32 0.48,42.48 v8.7,50.7
  Bottom 0.61: SW1.4 SW1.3
!RESET  (via drill 0.35)
  Top 0.406: U1.32 v3.1,24.11 v3.1,24.1
  Bottom 0.254: J3.10 21.76,52.24 TP1.1 21.17,52.07 20.6,51.5 20.3,51.2 11.8,51.2 11.7,51.2 11.4,51.2 9.68,49.48 9.68,41.42 8.3,40.04 8.3,40 5.14,36.84 5.14,24.64 4.6,24.1 v3.1,24.1
!SYS_LED_GREEN  (via drill 0.35)
  Top 0.254: v16.6,41.1 16.6,42.1 16.5,42.2 V2.G-K
  Top 0.305: U1.8 v25.19,27.41 v25.2,27.4
  Bottom 0.254: v25.2,27.4 23.1,27.4 16.6,33.9 v16.6,41.1
!SYS_LED_YELLOW  (via drill 0.35)
  Top 0.254: v15.9,41.4 15.9,41.8 15.5,42.2 V2.Y-K
  Top 0.305: v25.2,26.4 24.09,26.4 U1.7
  Bottom 0.254: 16.3,33.1 15.9,33.5 v15.9,41.4 | v25.2,26.4 23,26.4 16.6,32.8 16.3,33.1 | 16.3,33.1
BOARD_12V_ADC  (via drill 0.35)
  Top 0.2: 26.05,22.48 25.8,22.48 25.27,23.01 U1.4
  Top 0.254: v25.2,22.3 25.23,22.33 C13.1 26.05,22.48 | R24.1 R23.2 10.9,43.2 11,43.1 11,41.3 12.02,40.28 12.98,40.28 v12.99,40.29
  Bottom 0.254: v25.2,22.3 24.91,22.3 24.9,22.3 23.3,22.3 13.6,32 13.6,39.7 13.29,40.01 13.28,40.01 v12.99,40.29
BOARD_NTC_ADC  (via drill 0.35)
  Top 0.254: v26.04,23.06 25.47,23.63 C14.1 25.26,24.11 U1.5 | R22.1 R9.2 13.6,43.2 v14.5,42.3
  Bottom 0.254: v26.04,23.06 24.3,24.8 22.13,24.8 14.5,32.43 v14.5,42.3
BOARD_SUPPLY_ADC  (via drill 0.35)
  Top 0.254: v25.7,25.8 25.47,25.57 C2.1 25.26,25.21 U1.6 | R7.1 R8.2 12.4,43.2 12.5,43.1 12.5,41.8 13.9,40.4 v15.1,40.4
  Bottom 0.254: v25.7,25.8 25.5,25.6 22.7,25.6 15.1,33.2 v15.1,40.4
FAN_SPEED
  Top 0.305: J1.5_1 15.02,70.58 15.5,70.1 16.4,70.1 16.7,69.8 R1.1 18,67.5 18.36,67.14 Q1.3
  Top 0.61: J1.5_2 J1.5_1
FAN_SUPPLY
  Top 0.254: 13.9,68.8 13.9,67 Q2.D
  Top 0.305: J2.1_1 11.16,71.54 | 13.9,68.8 11.16,71.54 | D3.1 12.25,69.45 11.16,70.54 11.16,71.54
  Top 0.61: J2.1_2 J2.1_1
FAN_TECHO  (via drill 0.35)
  Top 0.254: R15.1 21,66.5 21,64 17.5,60.5 17.5,48.9 20,46.4 v20,45.5
  Top 0.305: U1.13 v25.19,32.91 v25.2,32.9 | J1.4_1 17.52,70.83 17.9,70.45 18.95,70.45 19.1,70.3 R15.1
  Top 0.61: J1.4_2 J1.4_1
  Bottom 0.254: v20,45.5 20,34.7 21.8,32.9 v25.2,32.9
GND  (via drill 0.35)
  Top 0.254: C2.2 26.43,25.1 26.43,26.17 v26.4,26.2 | R8.1 11.7,41.9 | R25.2 18.9,62.8 19.7,63.6
  Top 0.305: v3.01,32.91 v3,32.9
  Top 0.61: J1.2_2 J1.2_1
  Bottom 0.254: v3,32.9 1.27,31.17 TP9.1
  other vias: 26,63.5 25.2,29.6 3,19.7 3,20.8 3,21.9 25.4,19.7 25.4,20.8 25.3,21.5 3.5,39 2.5,40.5 24,39.6 24.9,39.6 24,43.5 1.5,38.5 3.1,29.5 5.7,38.4 3.1,28.6 22.8,29.7 5.8,29.6 26.1,35.9 25.3,35.9 1,12.5 1,13.5 1,18.5 1,19.5 1,20.5 1,21.5 1,22.5 1,23.5 1,24.5 1,25.5 1,26.5 1,29 1,32 1.5,34.5 1.5,39.5 5.5,39.5 2.2,43.3 3.2,44.3 1,49.5 1,51 1,52 1,53 1,54 1,55 1,56 1,57 1,58 1,63.5 1,62.5 1,68.5 1,69.5 1,74 1,75 1,79 2,79 3,79 4,79 5,79 6,79 7,79 8,79 9,79 10,79 11,79 12,79 13,79 14,79 15,79 16,79 17,79 18,79 19,79 20,79 21,79 22,79 23,79 24,79 25,79 26,79 26,75.5 26,74.5 26,73.5 26,70.5 26,69.5 26,68.5 26,61 26,60 26,59 26,58 26,55.5 26,54.5 26,53.5 26,52.5 26,51.5 26,50.5 26,49.5 26,48.5 26,47.5 26,46.5 25.5,45.5 26,12.5 26,13.5 26,14.5 26,15.5 26,16.5 26,17.5 26,18.5 26,27 26,28 26,29 26,31.5 26,32.5 7.6,66.5 9.1,68.8 8.5,66.5 12.3,64.1 12.5,66.5 15.6,65.9 15.6,66.8 9,63 8.7,64 6.7,61 9.5,61 9.5,62 10,57 11,56 17.3,45.6 13.9,41.3 12.5,40.9 17.3,40.5 21.5,40.5 24,44.4 26.4,39.5 26.4,38.6 26.4,37.7 26.4,36.8 9,51.6 10,52.5 6.7,59.9 20.1,65.1 20.1,64 9.1,43.1 7.7,40.4 15.1,41.2 12.5,47.3 14.8,48.9 14.8,43.2 14.1,46.6 16.7,63.6
  pour Top (isolate 0.254): 0.1,80 26.9,80 26.9,12 0.1,12
  pour Bottom (isolate 0.254): 0.1,80 26.9,80 26.9,12 0.1,12
  pour GND (isolate 0.254): 0.1,80 26.9,80 26.9,12 0.1,12
HA_NTC_ADC  (via drill 0.35)
  Top 0.15: R10.1 20.8,68.3 | v20.63,44.97 20.6,45
  Top 0.152: 25.44,34.01 C12.1
  Top 0.254: 21.5,67.4 21.5,63.88 17.96,60.34 17.96,49.04 20.6,46.4 20.6,45 | U1.14 25.44,34.01 | C12.1 26.33,34.07 v26.4,34
  Top 0.305: J1.1_1 25.02,70.82 23.4,69.2 23.4,67.8 23,67.4 21.5,67.4 20.9,67.4 20.7,67.6 20.7,68.2 20.8,68.3
  Top 0.61: J1.1_2 J1.1_1
  Bottom 0.15: 20.6,44.95 v20.63,44.97
  Bottom 0.254: v26.4,34 21.6,34 20.6,35 20.6,44.95
HEATER
  Top 0.305: J2.3_1 6.16,70.84 7.1,69.9 9.8,69.9 10.2,69.5 Q3.D
  Top 0.61: J2.3_2 J2.3_1
HEATER_PWM  (via drill 0.35)
  Top 0.15: v17.98,45 18,45.02
  Top 0.254: 18,45.02 18,46.55 15.6,48.95 15.6,60.6 15.2,61 14.2,61 11.8,63.4 R6.2 R5.1 | v25.2,28.5 U1.9
  Bottom 0.254: v17.98,45 17.98,33.62 23.1,28.5 v25.2,28.5
I2C_CLK
  Top 0.15: R16.1 20.1,60.1 | 21.2,61.2 J4.4
  Top 0.254: R16.1 19.35,60.1 18.73,59.48 18.73,56.6 22.3,53.02 22.39,52.93 22.39,46.66 22.5,46.56 22.5,35.67 23.05,35.11 U1.15 | 21.2,61.2 20.1,60.1
I2C_DATA
  Top 0.254: J4.3 21.2,60.2 20,59 R17.1 19.3,58.9 19.14,58.74 19.14,56.84 22.8,53.18 22.8,46.83 22.9,46.73 22.9,36.5 23.2,36.2 U1.16
JTAG_SWCLK  (via drill 0.35)
  Top 0.406: v5.8,28.5 U1.28
  Bottom 0.254: J3.4 22.69,48.43 TP2.1 | 21.35,49.19 19.9,47.74 17.25,47.74 6.4,36.9 6.4,29.1 v5.8,28.5
  Bottom 0.305: 21.35,49.19 21.59,49.19
  Bottom 0.406: 21.59,49.19 TP2.1
JTAG_SWDIO  (via drill 0.35)
  Top 0.406: v5.8,27.5 4.59,27.5 U1.29
  Bottom 0.254: J3.2 21.76,47.16 | 5.9,27.5 6.9,28.5 6.9,36.8 17.2,47.1 21.48,47.1 | 21.49,47.09 TP3.1
  Bottom 0.305: v5.8,27.5 5.9,27.5 | 21.48,47.1 21.49,47.09
  Bottom 0.406: 21.76,47.16 TP3.1
JTAG_SWO  (via drill 0.35)
  Top 0.254: U1.26 5.61,30.71 5.7,30.8 v5.72,30.8
  Top 0.305: U1.26 v3.11,30.71 v3.1,30.7
  Bottom 0.254: v3.1,30.7 1.67,29.27 1.67,28.34 TP8.1 | v5.72,30.8 5.72,36.3 5.72,36.52 5.72,36.85 8.7,39.83 8.7,39.88 17.34,48.51 19.77,48.51 20.49,49.23 20.49,49.67 21.23,50.41 21.95,50.41 22.66,49.7 J3.6
N$1
  Top 0.254: Q1.1 18.09,65.01 18.7,64.4 R3.1
N$2
  Top 0.254: R5.2 9.5,64.9 9.5,65.62 Q3.G
N$4
  Top 0.305: U2.7 12.9,59.85 13.2,60.15 L1.1
N$5
  Top 0.254: R26.1 16.45,59.95 Q5.B
N$6
  Top 0.305: FB1.2 6.97,64.49 | 4.85,63 D2.A
  Top 0.406: 6.97,64.49 C10.1 6.72,62.65 D2.A
  Top 0.61: Q4.D 4.85,63
N$7
  Top 0.305: Q4.G 1.35,59.65 R14.2
N$8
  Top 0.305: R21.2 15,45.4 V2.Y-A
N$9
  Top 0.305: R20.2 16.1,45.8 16.5,45.4 V2.G-A
N$10
  Top 0.305: R18.2 4.5,53.2 V1.Y-A
N$11
  Top 0.305: R19.2 V1.G-A
PMOSFET_EN
  Top 0.254: Q5.C 14.25,61.95 13.7,62.5 R2.1
  Top 0.305: Q2.G 13.25,63.75 R2.1
POWER_GOOD
  Top 0.254: U2.8 12.38,61.02 12.2,61.2 R11.1
SERIAL_RX  (via drill 0.35)
  Top 0.305: U1.23 v3.01,34.01 v3,34
  Bottom 0.254: v3,34 2.25,34 TP10.1
SERIAL_TX  (via drill 0.35)
  Top 0.305: U1.22 3.29,35.11 v2.9,35.5
  Bottom 0.254: v2.9,35.5 1.33,35.5
  Bottom 0.305: 1.33,35.5 TP11.1
VCC_+3.3V  (via drill 0.35)
  Top 0.254: R11.2 v10.3,61.7 | R7.2 v11.7,46.7 | R10.2 v21.7,69.6
  Top 0.305: R12.2 11.2,52.4 10.4,53.2 v10.4,53.3 | R17.2 v20,56.9 | J4.1 21.7,57 v21.9,56.8 | v21.1,62 20.8,62 20,61.2 R16.2 | v2.9,50.3 R13.2 | v14.24,47.55 14.74,47.55 R21.1 R20.1 | R18.1 R19.1 v6.6,55.1 | R15.2 v18.1,69.6 | U2.6 13.05,59.35 13.4,59 13.85,59 L1.2 | C6.1 12.8,57.35
  Top 0.406: U1.17 25.41,37.31 25.7,37.6 25.7,40.85 C1.1 C3.1 25.75,43.85 v25.5,44.1 | L1.2 14.2,57.7 13.9,57.4 C6.1 | 12.8,57.35 12.8,56.5 13,56.3 v14.6,56.3
  POWER 0.15: v18.1,69.6 18.6,70.1 21.2,70.1 v21.7,69.6
  POWER 0.254: v10.3,61.7 10.2,61.6 10.2,61.1 | v11.7,46.7 11.7,47.3
  POWER 0.305: v2.9,50.3 2.2,51 2.2,51.3 | v10.4,53.3 9.5,54.2 9.4,54.2 | v20,56.9 20.1,57 20.4,57 | v21.9,56.8 21.7,56.8 21.4,56.5 | v21.1,62 21,62.1 21,62.8
  pour POWER (isolate 0.254): 0,80 27,80 27,12.2 0,12.2
VDD  (via drill 0.35)
  Top 0.254: R24.2 10.2,47 11.6,48.4 13.3,48.4 14,49.1 14,50.8 v9.2,55.6 | R1.2 16.7,66.6 16.75,66.65 16.75,66.5 16.73,66.48
  Top 0.305: Q2.S 15.15,63.75 R2.2 15.4,63.3 16,63.9 v16,64 | 16.73,66.48 v16.73,65.17 | Q4.S 3.35,60.9 | U2.2 9.5,59.85 9.5,59.6 9.5,59.35 U2.3
  Top 0.406: 5.15,59.7 D2.K | 7.6,59.05 C5.1 8.22,59.17 8.65,59.6 9.5,59.6
  Top 0.508: J2.2_1 J2.2_2
  Top 0.61: 3.35,60.9 4.8,60.9 5.2,60.5 D2.K | v9.2,55.6 9.2,58.2 8.22,59.17 | 5.15,59.7 C11.1 6.15,57.6 7.6,59.05
  POWER 0.305: 11.7,68.86 11.7,68.7
  POWER 0.508: v9.2,55.6 7.8,57 7.8,64.5 8.3,65 11.7,65 | 11.7,65 16,65 | 16,65 16.73,65 v16.73,65.17 | v16,64 16,65 | 11.7,68.7 11.7,65 | J2.2_1 11.7,68.86
  Bottom 0.61: TP7.1 8.92,55.88 v9.2,55.6
VDDMAIN  (via drill 0.35)
  Top 0.254: R22.2 v13.3,46.6
  Top 0.406: U1.20 2.54,37.31 C4.1 1.35,37.45 v1.3,37.4
  POWER 0.254: v1.3,37.4 8.32,37.4 v11.15,40.23 11.12,40.26 11.12,40.74 13.3,42.92 v13.3,46.6
  Bottom 0.254: TP4.1 23.05,44.45 25,46.4 25,47.03 J3.1 23.82,46.11 21.03,46.11 20.54,46.6 17.3,46.6 11.1,40.4 11.1,40.28 v11.15,40.23
VDDRAW
  Top 0.406: D1.1 4.97,67.98 C9.1 4.97,64.77 FB1.1
  Top 0.61: J2.4_2 J2.4_1 3.66,70.84 4.65,69.85 D1.1
  Bottom 0.61: J2.4_1 4.78,70.78 4.78,56.18 TP6.1

### Text on the board
bPlace: GND | +12V | HEATER | HEATER | +12V_FAN | FAN_PWM | FAN_TECHO | FAN - | NTC | NTC | Vayu_R1A | Marolia | Licensed under CERN-OHL-P v2